# Altium schematic sheet power.SchDoc
size A3; SheetNumber: 1; SheetTotal: 1
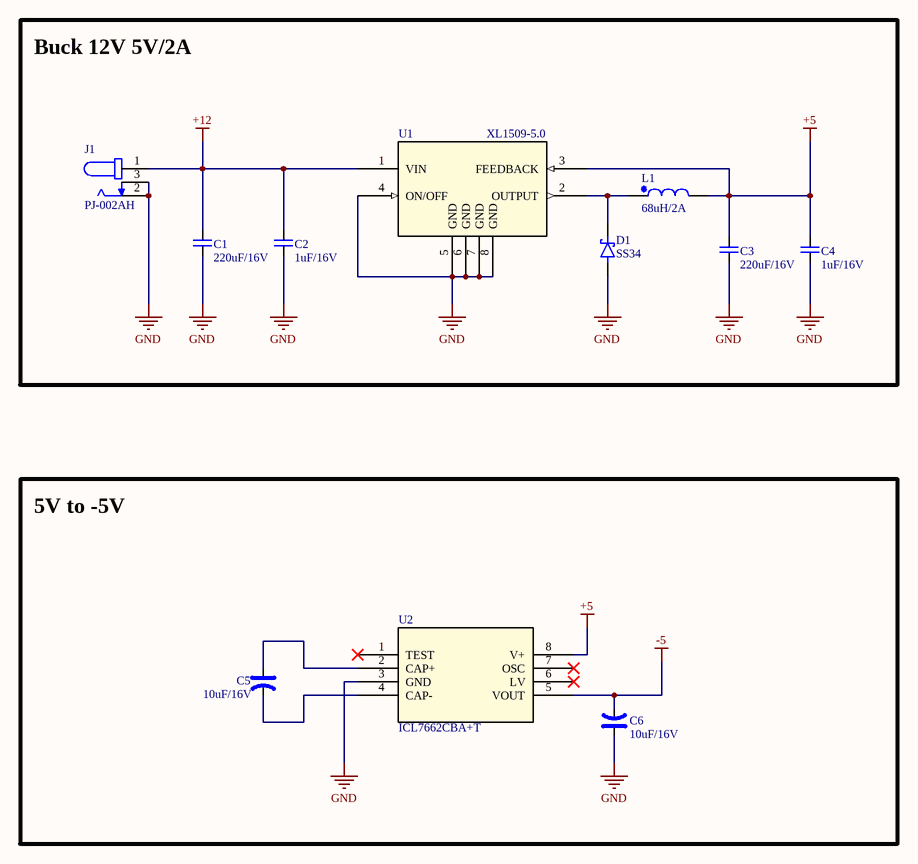
[diagram p0: power.SchDoc]

## Parts
C1  220uF/16V  [CAP_C_1608X80]
C2  1uF/16V  [CAP_C_1608X80]
C3  220uF/16V  [CAP_C_1608X80]
C4  1uF/16V  [CAP_C_1608X80]
C5  10uF/16V  [CAP_MP_1608X90]
C6  10uF/16V  [CAP_MP_1608X90]
D1  SS34  [DIOM7959X265N]
J1  PJ-002AH  [CUI_PJ-002AH]
L1  68uH/2A  [IND730660x480]
U1  XL1509-5.0  [SOP8SOIC-8_UMW]
U2  ICL7662CBA+T  [21-0041B_8_MXM]

## Blocks framed on the sheet
Buck 12V 5V/2A: C1-C4 D1 J1 L1 U1
5V to -5V: C5 C6 U2

## Nets
+5: C3.2 C4.2 L1.2 U1.3(FEEDBACK) U2.8(V+)
+12: C1.2 C2.2 J1.1 U1.1(VIN)
-5: C6.2 U2.5(VOUT)
GND: C1.1 C2.1 C3.1 C4.1 C6.1 D1.A J1.2 J1.3 U1.4(ON/OFF) U1.5(GND) U1.6(GND) U1.7(GND) U1.8(GND) U2.3(GND)
NetC5_1: C5.1 U2.2(CAP+)
NetC5_2: C5.2 U2.4(CAP-)
NetD1_C: D1.C(K) L1.1 U1.2(OUTPUT)

Not connected (* = marked no-connect by the designer): U2 1(TEST)* 6(LV)* 7(OSC)*

## Notes on the sheet
- Project:
- Sub-system:
- Designed by:
- Sheet title:
- Sheet
- of
- Checked by:
- Approved by:
- Doc No:
- Revision:
- Size:
- Date:
- A3

## Library data of the parts
C1-C4 = CAP_SMD: CAP_Chip; Value: 33pF
C5 C6 = CAP_TH: CAP_Polarization; Published: 8-Jun-2000; LatestRevisionDate: 17-Jul-2002; LatestRevisionNote: Re-released for DXP Platform.; PackageReference: POLAR0.8; Publisher: Altium Limited
D1 = SS34: Diode Schottky 40 V 3A Surface Mount SMC (DO-214AB); MF: onsemi; SnapEDA_Link: https://www.snapeda.com/parts/SS34/Onsemi/view-part/?ref=snap; Package: SMC-2 ON Semiconductor; Value: *; MP: SS34; Check_prices: https://www.snapeda.com/parts/SS34/Onsemi/view-part/?ref=eda
J1 = PJ-002AH: 2.0 x 6.5 mm, 5.0 A, Horizontal, Through Hole, Dc Power Jack Connector; MF: Same Sky; SnapEDA_Link: https://www.snapeda.com/parts/PJ-002AH/Same+Sky/view-part/?ref=snap; Package: None; Value: *; MP: PJ-002AH; Check_prices: https://www.snapeda.com/parts/PJ-002AH/Same+Sky/view-part/?ref=eda
L1 = _IND
U1 = XL1509-5.0: Description; Manufacturer_Name: UMW(Youtai Semiconductor Co., Ltd.); Copyright: Copyright (C) 2025 Ultra Librarian. All rights reserved.; Manufacturer_Part_Number: XL1509-5.0; RefDes: RefDes; Type: Type
U2 = ICL7662CBA+T: CMOS Voltage Converters; Manufacturer_Name: Analog Devices / Maxim Integrated; Copyright: Copyright (C) 2025 Ultra Librarian. All rights reserved.; Manufacturer_Part_Number: ICL7662CBA+T; RefDes: RefDes; Type: Type